# Altium schematic sheet USR_IO_IPMI.SchDoc: USER IO IPMI
size 420 x 297 mm; Organization: Altium Limited; Address1: L3, 12a Rodborough Rd; Address2: Frenchs Forest; Address3: NSW; Address4: Australia 2086; SheetNumber: 8; SheetTotal: 8
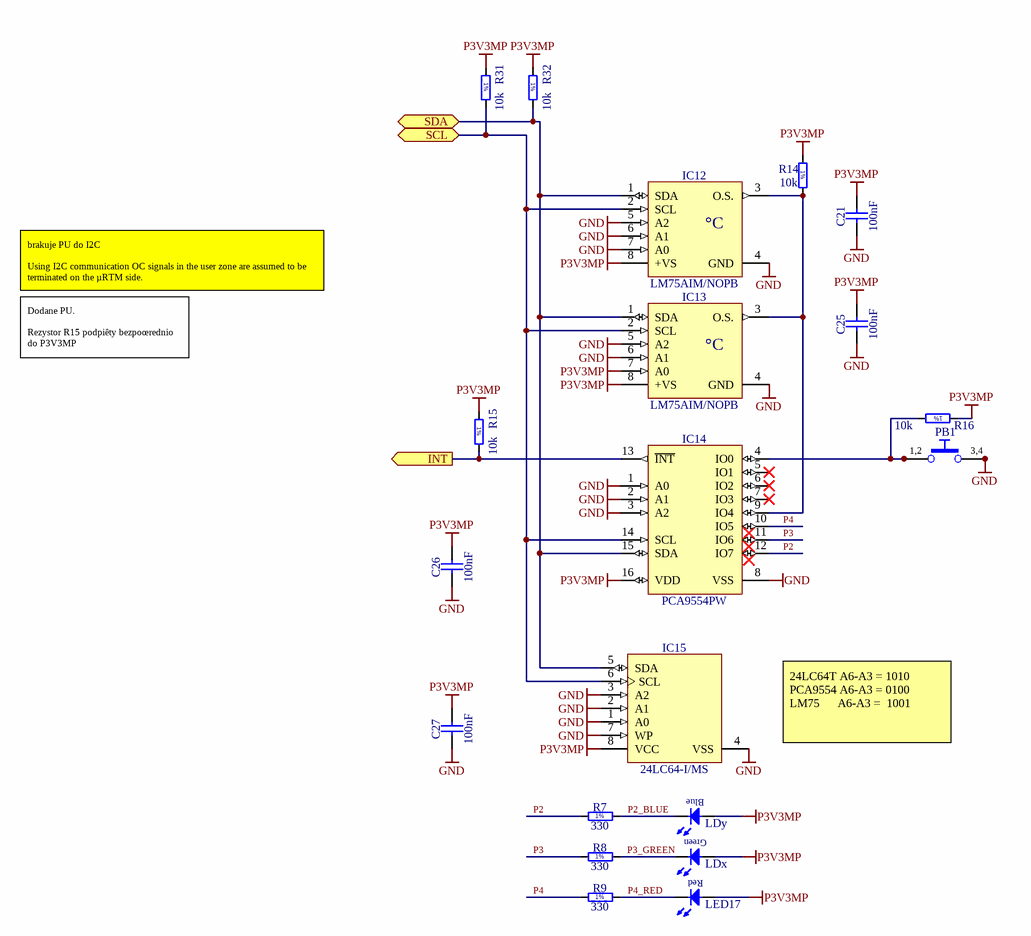
[diagram p0: USR_IO_IPMI.SchDoc]

## Parts
C21  100nF  [CAPC1005X55N]
C25  100nF  [CAPC1005X55N]
C26  100nF  [CAPC1005X55N]
C27  100nF  [CAPC1005X55N]
IC12  LM75AIM/NOPB  [SOIC127P600X175-8N]
IC13  LM75AIM/NOPB  [SOIC127P600X175-8N]
IC14  PCA9554PW  [SOP65P640X110-16N]
IC15  24LC64-I/MS  [SOP65P490X110-8N]
LDx  Green  [LED_AVAGO_HSME-C120]  (value not drawn)
LDy  Blue  [LED_AVAGO_HSMR-C120]  (value not drawn)
LED17  Red  [LEDC1608X80N_RED]  (value not drawn)
PB1  Push Button  [SW_C&K_HDT0001]  (value not drawn)
R7  330  [RESC1608X55N]
R8  330  [RESC1608X55N]
R9  330  [RESC1608X55N]
R14  10k  [RESC1005X40N]
R15  10k  [RESC1005X40N]
R16  10k  [RESC1005X40N]
R31  10k  [RESC1005X40N]
R32  10k  [RESC1005X40N]

## Ports
INT (out), SCL (bidir), SDA (bidir)

## Nets
GND: C21.2 C25.2 C26.2 C27.2 IC12.4(GND) IC12.5(A2) IC12.6(A1) IC12.7(A0) IC13.4(GND) IC13.5(A2) IC13.6(A1) IC14.1(A0) IC14.2(A1) IC14.3(A2) IC14.8(VSS) IC15.1(A0) IC15.2(A1) IC15.3(A2) IC15.4(VSS) IC15.7(WP) PB1.3 PB1.4
P3V3MP: C21.1 C25.1 C26.1 C27.1 IC12.8(+VS) IC13.7(A0) IC13.8(+VS) IC14.16(VDD) IC15.8(VCC) LDx.2(A) LDy.2(A) LED17.2(A) R14.1 R15.1 R16.1 R31.1 R32.1
INT: IC14.13(~{INT}) R15.2 ; port INT
P2: IC14.12(IO7) R7.1
P2_BLUE: LDy.1(C) R7.2
P3: IC14.11(IO6) R8.1
P3_GREEN: LDx.1(C) R8.2
P4: IC14.10(IO5) R9.1
P4_RED: LED17.1(C) R9.2
SCL: IC12.2(SCL) IC13.2(SCL) IC14.14(SCL) IC15.6(SCL) R31.2 ; port SCL
SDA: IC12.1(SDA) IC13.1(SDA) IC14.15(SDA) IC15.5(SDA) R32.2 ; port SDA
NetIC12_3: IC12.3(O.S.) IC13.3(O.S.) IC14.9(IO4) R14.2
NetIC14_4: IC14.4(IO0) PB1.1 PB1.2 R16.2

Not connected (* = marked no-connect by the designer): IC14 5(IO1)* 6(IO2)* 7(IO3)*

## Notes on the sheet
- brakuje PU do I2C
  Using I2C communication OC signals in the user zone are assumed to be terminated on the µRTM side.
- Dodane PU.
  Rezystor R15 podpiêty bezpoœrednio do P3V3MP
- 24LC64T A6-A3 = 1010
  PCA9554 A6-A3 = 0100
  LM75      A6-A3 =  1001
- Project/Equipment
- Document
- uTCA RTM 8 SFP+
- Designer
- Drawn by
- Check.by
- Copyright Creotech Instruments SA 2014.
  This documentation describes Open Hardware and is licensed under the CERN OHL v.1.1. You may redistribute and modify this documentation under the terms of the CERN OHL v.1.1. (http://ohwr.org/CERNOHL). This documentation is distributed WITHOUT ANY EXPRESS OR IMPLIED WARRANTY, INCLUDING OF MERCHANTABILITY, SATISFACTORY QUALITY AND FITNESS FOR A PARTICULAR PURPOSE. Please see the CERN OHL v.1.1 for applicable conditions.
- Creotech Instruments S.A.
- File
- Last Mod.
- Print Date
- Sheet
- Size
- A3
- of
- Rev
- (in symbol LM75AIM/NOPB) °C
- (in symbol R0402_10K_1%_0.0625W_100PPM) 1%
- (in symbol R0603_330R_1%_0.1W_100PPM) 1%
- (in symbol SW_C&K_HDT0001) 1,2; 3,4

## Library data of the parts
C21 C25-C27 = CC0402_100NF_16V_10%_X7R: Non-polarised capacitor; Part Description: SMD Multilayer Chip Ceramic Capacitor; Manufacturer: GENERIC; Manufacturer1 Part Number: 223878715649; Voltage: 16V; TC: X7R; Tolerance: ±10%; Table: Capacitors SMD; Part Number: CC0402_100NF_16V_10%_X7R; Component Kind: Standard; Component Type: Standard; Pin Count: 2; Value: 100nF; Status: Not Recommended; Manufacturer Part Number: CC0402_100NF_16V_10%_X7R; Case: 0402; Mounted: Yes; Socket: No; SMD: Yes; Manufacturer1 Example: PHYCOMP; Manufacturer1 ComponentHeight: 0.55mm; HelpURL: \\cern.ch\dfs\Applications\Altium\Datasheets\CC0402_X7R_PHYCOMP.pdf; Author: CERN DEM JLC; CreateDate: 12/3/2007; LatestRevisionDate: 12/3/2007
IC12 IC13 = LM75AIM/NOPB: Digital Temperature Sensor and Thermal Watchdog with Two-Wire Interface; Part Description: -25° to +100°C ±2°C Digital Temperature Sensor and Thermal Watchdog with Two-Wire Interface; Manufacturer: TEXAS INSTRUMENTS; PressFit: No; Bonding: No; Part Number: LM75AIM/NOPB; Component Kind: Standard; Component Type: Standard; Device: LM75AIM/NOPB; PackageDescription: SOIC 8, Pitch 1.27mm - Body 4x5mm, IPC Medium Density; Manufacturer Part Number: LM75AIM/NOPB; Pin Count: 8; Case: SOIC8; Mounted: Yes; Socket: No; SMD: Yes; Sense: No; ComponentHeight: 1.75mm; HelpURL: \\cern.ch\dfs\Applications\Altium\Datasheets\LM75AIM-NOPB.pdf; Author: CERN DEM JLC; CreateDate: 15/10/2012; LatestRevisionDate: 15/10/2012
IC14 = PCA9554PW: 8-Bit I2C-Bus and SMBus I/O Port with Interrupt; Manufacturer: NXP SEMICONDUCTORS; PressFit: No; Bonding: No; Part Number: PCA9554PW; Component Kind: Standard; Component Type: Standard; Device: PCA9554PW; PackageDescription: SOP, 0.65mm pitch; 16 pin, 4.40mm W X 5.00mm L X 1.10mm H body IPC Medium Density; Part Description: 8-Bit I2C-Bus and SMBus I/O Port with Interrupt; Manufacturer Part Number: PCA9554PW; Pin Count: 16; Case: TSSOP16; Mounted: Yes; Socket: No; SMD: Yes; Sense: No; ComponentHeight: 1.1mm; Author: CERN DEM JLC; HelpURL: \\cern.ch\dfs\Applications\Altium\Datasheets\PCA9554PW.pdf; CreateDate: 04/11/2014; LatestRevisionDate: 04/11/2014
IC15 = 24LC64-I/MS: 64K I2C Serial EEPROM; Part Description: 2.5V-5.5V, 64K (8K x 8-bit) I2C Serial EEPROM; Manufacturer: MICROCHIP TECHNOLOGY; Table: Logic; Part Number: 24LC64-I/MS; Component Kind: Standard; Component Type: Standard; Device: 24LC64-I/MS; PackageDescription: SOP, 0.65mm pitch; 8 pin, 3.00mm W X 3.00mm L X 1.10mm H body, IPC Medium Density; Manufacturer Part Number: 24LC64-I/MS; Pin Count: 8; Case: MSOP8; Mounted: Yes; Socket: No; SMD: Yes; ComponentHeight: 1.1mm; HelpURL: \\cern.ch\dfs\Applications\Altium\Datasheets\24LC64-I-MS.pdf; Author: CERN DEM JLC; CreateDate: 2011-01-24; LatestRevisionDate: 2011-01-24
LDx = LED_AVAGO_HSME-C120: LED Green 1C 2A; Part Description: High Performance Right Angle Chip Green LED; Manufacturer: AVAGO TECHNOLOGIES; PressFit: No; Bonding: No; Part Number: LED_AVAGO_HSME-C120; Component Kind: Standard; Component Type: Standard; Color: Green; PackageDescription: Green Chip LED, 2-Leads, Body 1.7x1.1mm, Side Emitting Package; Manufacturer Part Number: HSME-C120; Pin Count: 2; Mounted: Yes; Socket: No; SMD: Yes; Sense: No; ComponentHeight: 0.7mm; HelpURL: \\cern.ch\dfs\Applications\Altium\Datasheets\LED_AVAGO_HSME-C120.pdf; ComponentLink1URL: \\cern.ch\dfs\Applications\Altium\Datasheets\LED_AVAGO_HSME-C110_DESIGN-GUIDE.pdf; ComponentLink1Description: Design Guide; Author: CERN DEM JMW; CreateDate: 22/07/2009; LatestRevisionDate: 20/06/2012
LDy = LED_AVAGO_HSMR-C120: LED Blue 1C 2A; Part Description: High Performance Right Angle Chip InGaN Blue LED; Manufacturer: AVAGO TECHNOLOGIES; PressFit: No; Bonding: No; Part Number: LED_AVAGO_HSMR-C120; Component Kind: Standard; Component Type: Standard; Color: Blue; Footprint: LED_AVAGO_HSME-C120; PackageDescription: Blue Chip LED, 2-Leads, Body 1.7x1.1mm, Side Emitting Package; Manufacturer Part Number: HSMR-C120; Pin Count: 2; Mounted: Yes; Socket: No; SMD: Yes; Sense: No; ComponentHeight: 0.7mm; HelpURL: \\cern.ch\dfs\Applications\Altium\Datasheets\LED_AVAGO_HSMR-C120.pdf; Author: CERN DEM JLC; CreateDate: 07/07/2014; LatestRevisionDate: 07/07/2014
LED17 = LED_ROHM_SML-311UTT86K: LED Red 1C 2A; Part Description: Low current chip LED SML-311 Serie; Manufacturer: ROHM; PressFit: No; Bonding: No; Part Number: LED_ROHM_SML-311UTT86K; Component Kind: Standard; Component Type: Standard; Color: Red; PackageDescription: Chip Red LED, 2-Leads, Body 1.6x0.8mm, IPC Medium Density; Manufacturer Part Number: SML-311UTT86K; Pin Count: 2; Mounted: Yes; Socket: No; SMD: Yes; Sense: No; ComponentHeight: 0.8mm; HelpURL: \\cern.ch\dfs\Applications\Altium\Datasheets\LED_ROHM_SML-311UTT86K.pdf; Author: CERN DEM JLC; CreateDate: 16/03/2010; LatestRevisionDate: 17/03/2010
PB1 = SW_C&K_HDT0001: Push-Button Switch SPDT; Part Description: 5VDC 1mA SPST-NO Micro Mini Surface Surface Mount Detect Push-Button Switch, HDT Serie; Manufacturer: C&K; Table: Switches; Part Number: SW_C&K_HDT0001; Component Kind: Standard; Component Type: Standard; Pin Count: 4; PackageDescription: Body 3.5x2.8mm, Micro Mini Surface Mount Detect Switches, HDT Serie; Family: Push Button; Mounted: Yes; Socket: No; SMD: Yes; Status: None; Manufacturer Part Number: HDT0001; ComponentHeight: 3.35mm; HelpURL: \\cern.ch\dfs\Applications\Altium\Datasheets\SW_C&K_HDT0001.pdf; Author: CERN DEM JLC; CreateDate: 2012-08-15; LatestRevisionDate: 2012-08-15
R7-R9 = R0603_330R_1%_0.1W_100PPM: Resistor - 1%; Part Description: General Purpose Thick Film Chip Resistor; Manufacturer: GENERIC; Manufacturer1 Part Number: NRC06F3300TRF; Power: 0.1W; TC: ±100ppm/°C; Table: Resistors SMD; Part Number: R0603_330R_1%_0.1W_100PPM; Component Kind: Standard; Component Type: Standard; Pin Count: 2; Value: 330; Status: Preferred; Tolerance: ±1%; Manufacturer Part Number: R0603_330R_1%_0.1W_100PPM; Case: 0603; Mounted: Yes; Socket: No; SMD: Yes; Manufacturer1 Example: NIC COMPONENT; Manufacturer1 ComponentHeight: 0.55mm; HelpURL: \\cern.ch\dfs\Applications\Altium\Datasheets\R0603_NIC_NRC.pdf; Author: CERN DEM JLC; CreateDate: 2007-12-03; LatestRevisionDate: 2008-03-13
R14-R16 R31 R32 = R0402_10K_1%_0.0625W_100PPM: Resistor - 1%; Part Description: General Purpose Thick Film Chip Resistor; Manufacturer: GENERIC; Manufacturer1 Part Number: 232270671003L; TC: ±100ppm/°C; Table: Resistors SMD; Part Number: R0402_10K_1%_0.0625W_100PPM; Component Kind: Standard; Component Type: Standard; Pin Count: 2; Value: 10k; Status: Not recommended; Power: 0.0625W; Tolerance: ±1%; Manufacturer Part Number: R0402_10K_1%_0.0625W_100PPM; Case: 0402; Mounted: Yes; Socket: No; SMD: Yes; Manufacturer1 Example: YAGEO PHYCOMP; Manufacturer1 ComponentHeight: 0.4mm; HelpURL: \\cern.ch\dfs\Applications\Altium\Datasheets\R0402_Phycomp_RC0402.pdf; Author: CERN DEM JLC; CreateDate: 2007-12-03; LatestRevisionDate: 2012-10-17